# Altium schematic sheet Adapter.SchDoc
size A4
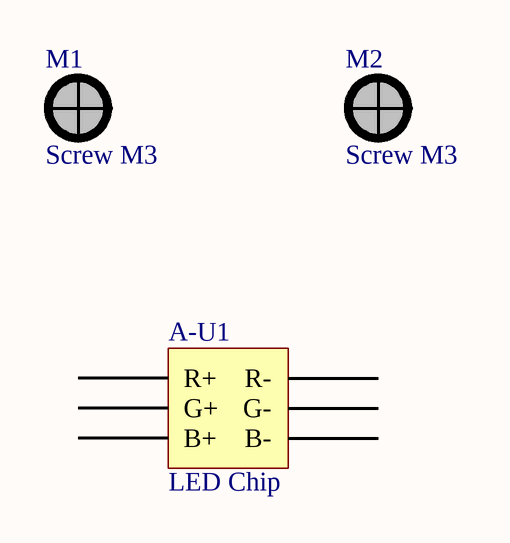
[diagram p0: Adapter.SchDoc]

## Parts
A-U1  LED Chip  [LED Chip RGB 100W CUT]
M1  Screw M3  [Screw M3]
M2  Screw M3  [Screw M3]

## Nets

Not connected (* = marked no-connect by the designer): A-U1 1(R+) 2(G+) 3(B+) 4(B-) 5(G-) 6(R-)

## Library data of the parts
A-U1 = LED Chip RGB 100W